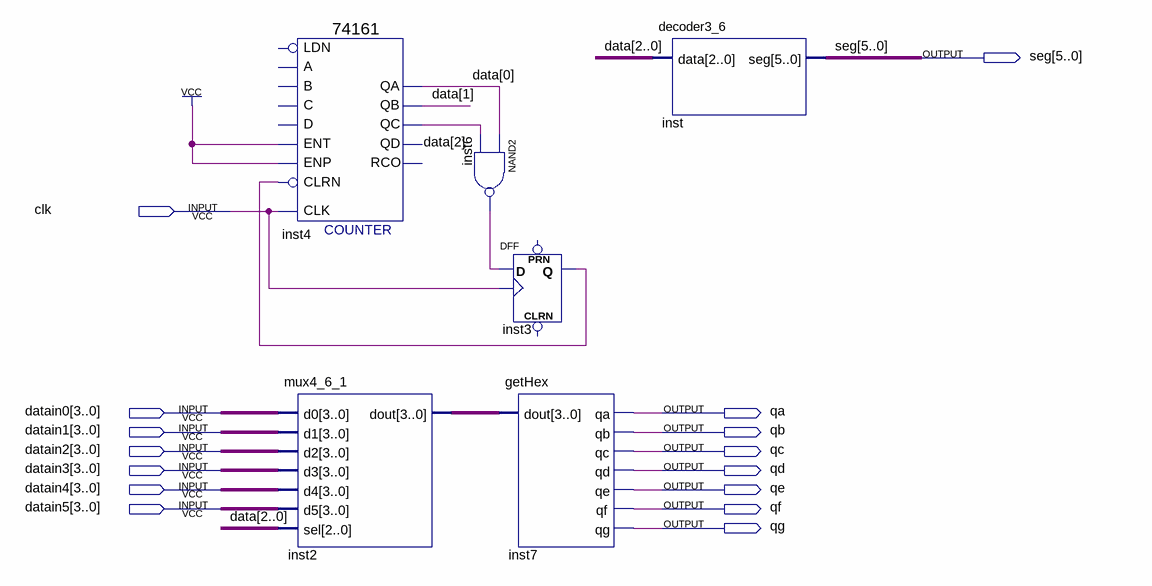
[diagram p0: schematic sheet]
// Quartus schematic showOut.bdf as structural Verilog: 6 symbols, 15 pins
module showOut (
  input  clk,
  input  [3:0] datain0,
  input  [3:0] datain1,
  input  [3:0] datain2,
  input  [3:0] datain3,
  input  [3:0] datain4,
  input  [3:0] datain5,
  output [5:0] seg,
  output qa,
  output qb,
  output qc,
  output qd,
  output qe,
  output qf,
  output qg
);

  wire inst3_q, inst6_out;
  wire [2:0] data;
  wire [3:0] inst2_dout;

  \74161  inst4 (
    .CLRN(inst3_q), .CLK(clk), .ENP(1'b1), .ENT(1'b1), .QC(data[2]), .QB(data[1]), .QA(data[0]));  // open: LDN, A, D, B, C, QD, RCO
  mux4_6_1 inst2 (
    .d0(datain0), .d1(datain1), .d2(datain2), .d3(datain3), .d4(datain4), .d5(datain5), .sel(data),
    .dout(inst2_dout));
  nand inst6 (inst6_out, data[0], data[2]);
  DFF inst3 (.CLK(clk), .D(inst6_out), .Q(inst3_q));  // open: CLRN, PRN
  getHex inst7 (.dout(inst2_dout), .qa(qa), .qb(qb), .qc(qc), .qd(qd), .qe(qe), .qf(qf), .qg(qg));
  decoder3_6 inst (.data(data), .seg(seg));
endmodule
